# Altium schematic sheet Measure_Source.SchDoc
size A; SheetNumber: 6; SheetTotal: 9
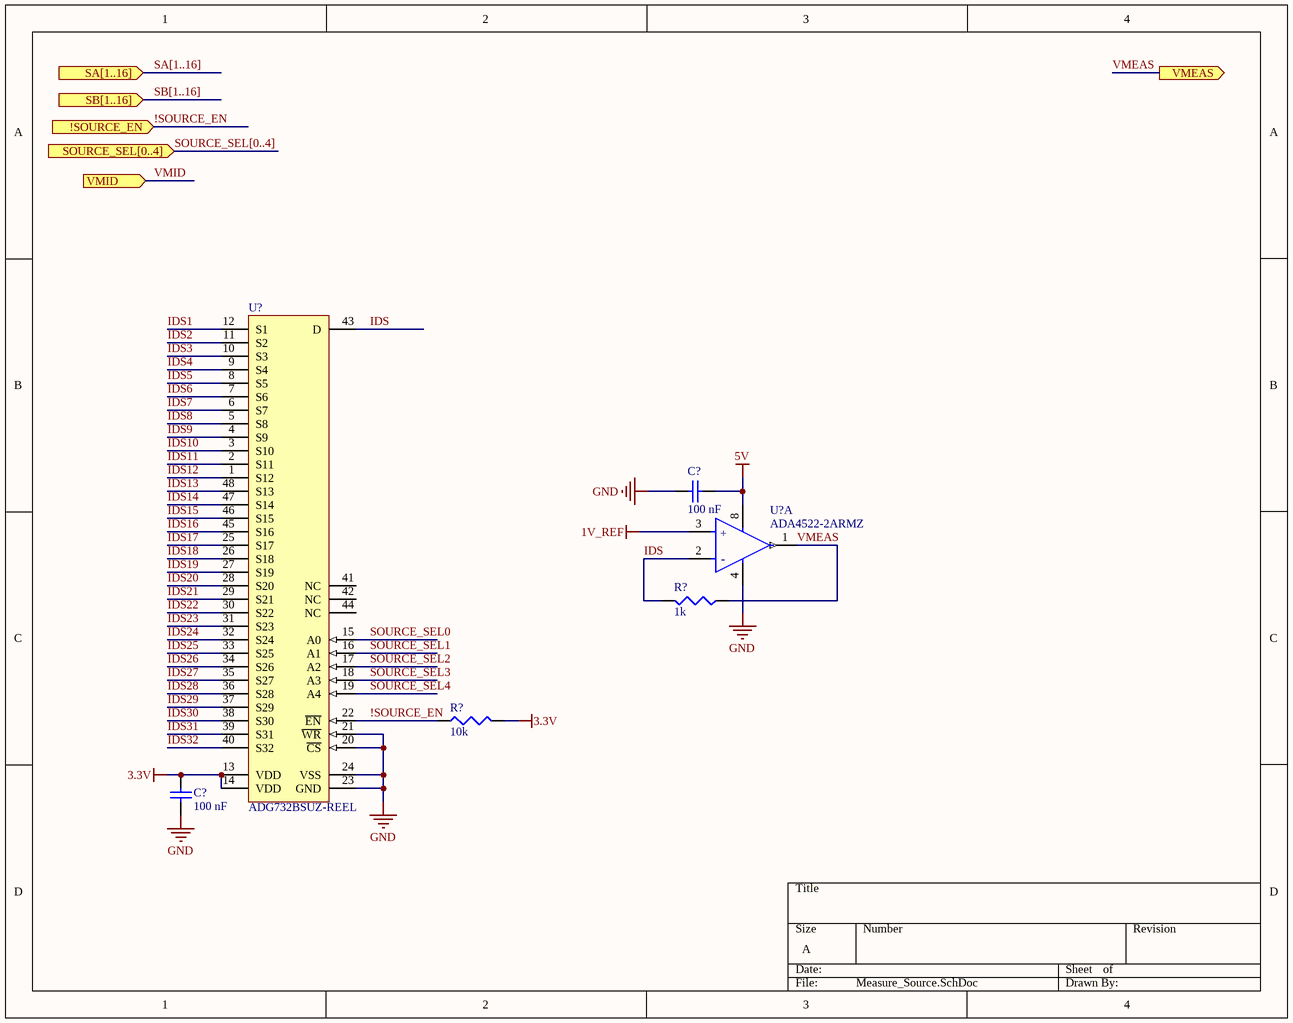
[diagram p0: Measure_Source.SchDoc]

## Parts
(Parts that share a designator on the sheet are numbered #1, #2 ... from top to bottom, then left to right.)
C?#1  100 nF  [1608[0603]]
C?#2  100 nF  [1608[0603]]
R?#1  1k  [J1-0603]
R?#2  10k  [J1-0603]
U?#1  ADG732BSUZ-REEL  [ADI-SU-48_N]
U?#2  ADA4522-2ARMZ  [FP-RM-8-IPC_C]  (part A of 2)

## Ports
!SOURCE_EN (in), SA[1..16] (in), SB[1..16] (in), SOURCE_SEL[0..4] (in), VMEAS (out), VMID (in)

## Nets
1V_REF: U?#2.3(+IN_A)
3.3V: C?#2.2 R?#2.2 U?#1.13(VDD) U?#1.14(VDD)
5V: C?#1.2 U?#2.8(V+)
GND: C?#1.1 C?#2.1 U?#1.20(~{CS}) U?#1.21(~{WR}) U?#1.23(GND) U?#1.24(VSS) U?#2.4(V-)
!SOURCE_EN: R?#2.1 U?#1.22(~{EN}) ; port !SOURCE_EN
IDS: R?#1.2 U?#1.43(D) U?#2.2(-IN_A)
IDS1: U?#1.12(S1)
IDS2: U?#1.11(S2)
IDS3: U?#1.10(S3)
IDS4: U?#1.9(S4)
IDS5: U?#1.8(S5)
IDS6: U?#1.7(S6)
IDS7: U?#1.6(S7)
IDS8: U?#1.5(S8)
IDS9: U?#1.4(S9)
IDS10: U?#1.3(S10)
IDS11: U?#1.2(S11)
IDS12: U?#1.1(S12)
IDS13: U?#1.48(S13)
IDS14: U?#1.47(S14)
IDS15: U?#1.46(S15)
IDS16: U?#1.45(S16)
IDS17: U?#1.25(S17)
IDS18: U?#1.26(S18)
IDS19: U?#1.27(S19)
IDS20: U?#1.28(S20)
IDS21: U?#1.29(S21)
IDS22: U?#1.30(S22)
IDS23: U?#1.31(S23)
IDS24: U?#1.32(S24)
IDS25: U?#1.33(S25)
IDS26: U?#1.34(S26)
IDS27: U?#1.35(S27)
IDS28: U?#1.36(S28)
IDS29: U?#1.37(S29)
IDS30: U?#1.38(S30)
IDS31: U?#1.39(S31)
IDS32: U?#1.40(S32)
SOURCE_SEL0: U?#1.15(A0)
SOURCE_SEL1: U?#1.16(A1)
SOURCE_SEL2: U?#1.17(A2)
SOURCE_SEL3: U?#1.18(A3)
SOURCE_SEL4: U?#1.19(A4)
VMEAS: R?#1.1 U?#2.1(OUT_A) ; port VMEAS
VMID: port VMID

Not connected (* = marked no-connect by the designer): U?#1 41(NC) 42(NC) 44(NC)

## Buses and harness runs
bus SA[1..16] = port SA[1..16]
bus SB[1..16] = port SB[1..16]
bus SOURCE_SEL[0..4] = port SOURCE_SEL[0..4]

## Notes on the sheet
- (in symbol CMP-09116-000003-2, part A) +; -

## Library data of the parts
C?#1 C?#2 = Cap Semi: Published: 8-Jun-2000; LatestRevisionDate: 29-May-2009; LatestRevisionNote: IPC-7351 Footprint Added.; PackageReference: C1206; Publisher: Altium Limited; PackageDescription: Chip Capacitor
R?#1 R?#2 = Res3: Resistor; Published: 8-Jun-2000; LatestRevisionDate: 29-May-2009; LatestRevisionNote: IPC-7351 Footprint Added.; PackageReference: J1-0603; Publisher: Altium Limited; PackageDescription: Chip Resistor
U?#1 = CMP-0798-00236-1: 1.8 to 5.5 V / +/-2.5 V, 4 Ohm, 32-Channel Analog Multiplexer, -40 to 85 degC, 48-pin QFP (SU-48), Reel; Manufacturer: Analog Devices; Ron (ohms): 4; Max Analog Signal Range: Vss to Vdd; Bandwidth (Hz): 18M; Supply V Guar Performance: Dual_(+/-2.5V), Single_(+3V), Single_(+5V); t transition (s): 23n; PackageReference: SU-48; ComponentLink3URL: http://www.analog.com/static/imported-files/packages/470644706845302410119987SU48_7x7.pdf; PartNumber: ADG732BSUZ-REEL; ComponentLink1URL: http://www.analog.com/en/index.html; Mounting Technology: Surface Mount; ComponentLink2Description: Datasheet; Packing: Reel; ComponentLink1Description: Manufacturer URL; DatasheetVersion: Rev. 0; ComponentLink2URL: http://www.analog.com/static/imported-files/data_sheets/ADG726_732.pdf; PackageDescription: 48-Pin Thin Plastic Quad Flat Package, Body 7 x 7 mm, Pitch 0.5 mm; Code_JEDEC: MS-026ABC; ComponentLink3Description: Package Specification
U?#2 = CMP-09116-000003-2: IC OPAMP ZERO-DRIFT 2 CIRC 8MSOP; Max Dual Supply Voltage: 27.5V; Power Supply Rejection Ratio (PSRR): 150dB; Operating Supply Current: 830uA; Max Supply Voltage: 55V; Min Dual Supply Voltage: 2.25V; Input Bias Current: 50pA; Gain Bandwidth Product: 2.7MHz; Voltage Gain: 137dB; Common Mode Rejection Ratio: 140dB; Slew Rate: 1.7V/µs; Input Offset Voltage (Vos): 1.5uV; Output Current per Channel: 32mA; Min Supply Voltage: 4.5V; Packaging: Rail/Tube; Max Operating Temperature: 125°C; Min Operating Temperature: -40°C; Mount: Surface Mount; Number of Pins: 8; Case/Package: MSOP; Lead Free: Contains Lead